# EAGLE design shupito (EAGLE 6.3)
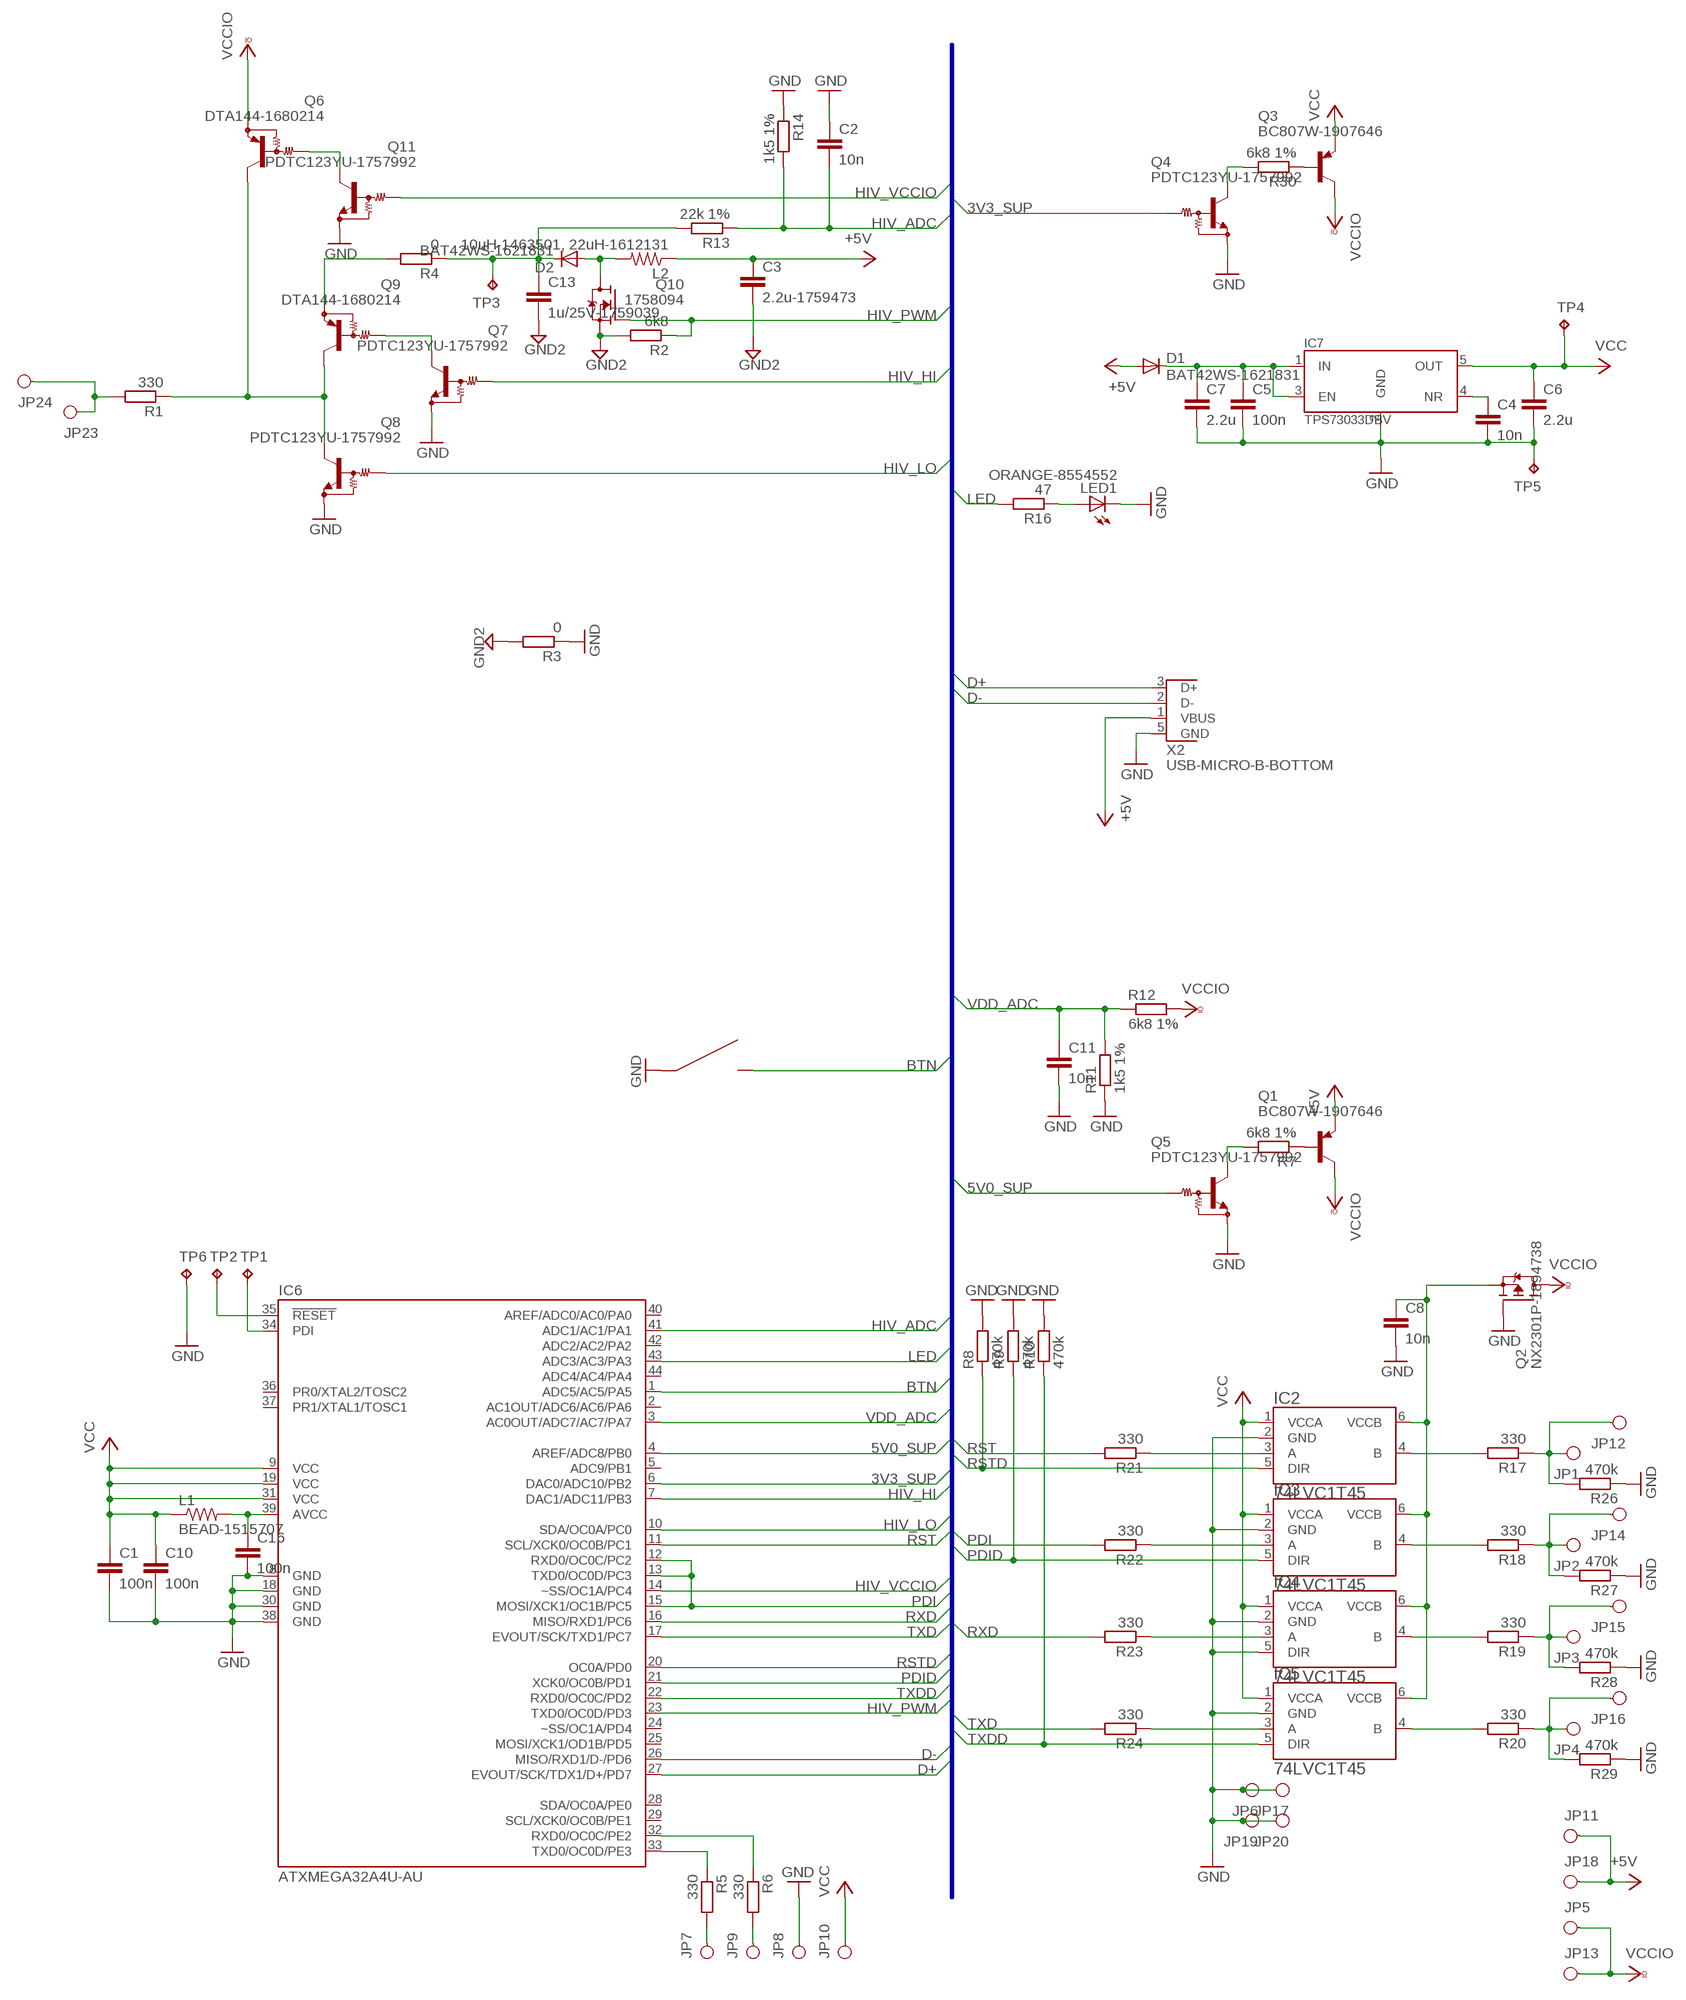
[diagram p0: schematic, sheet 1]

## Parts
C1  100n  C-EUC0603K  [C0603K]
C2  10n  C-EUC0603K  [C0603K]
C3  2.2u-1759473  C-EUC0603K  [C0603K]
C4  10n  C-EUC0603K  [C0603K]
C5  100n  C-EUC0603K  [C0603K]
C6  2.2u  C-EUC0603K  [C0603K]
C7  2.2u  C-EUC0603K  [C0603K]
C8  10n  C-EUC0603K  [C0603K]
C10  100n  C-EUC0603K  [C0603K]
C11  10n  C-EUC0603K  [C0603K]
C13  1u/25V-1759039  C-EUC0603K  [C0603K]
C16  100n  C-EUC0603K  [C0603K]
D1  BAT42WS-1621831  DIODE-SOD323  [SOD323]
D2  BAT42WS-1621831  DIODE-SOD323  [SOD323]
IC2  74LVC1T45  74LVC1T45DBV  [SOT236]
IC3  74LVC1T45  74LVC1T45DBV  [SOT236]
IC4  74LVC1T45  74LVC1T45DBV  [SOT236]
IC5  74LVC1T45  74LVC1T45DBV  [SOT236]
IC6  ATXMEGA32A4U-AU  [TQFP44]
IC7  TPS73033DBV  [SOT23-DBV]
JP1  PINH1X01SMD  [PINH1X01SMD]
JP2  PINH1X01SMD  [PINH1X01SMD]
JP3  PINH1X01SMD  [PINH1X01SMD]
JP4  PINH1X01SMD  [PINH1X01SMD]
JP5  PINH1X01SMD  [PINH1X01SMD]
JP6  PINH1X01SMD  [PINH1X01SMD]
JP7  PINH1X01SMD  [PINH1X01SMD]
JP8  PINH1X01SMD  [PINH1X01SMD]
JP9  PINH1X01SMD  [PINH1X01SMD]
JP10  PINH1X01SMD  [PINH1X01SMD]
JP11  PINH1X01SMD  [PINH1X01SMD]
JP12  PINH1X01SMD  [PINH1X01SMD]
JP13  PINH1X01SMD  [PINH1X01SMD]
JP14  PINH1X01SMD  [PINH1X01SMD]
JP15  PINH1X01SMD  [PINH1X01SMD]
JP16  PINH1X01SMD  [PINH1X01SMD]
JP17  PINH1X01SMD  [PINH1X01SMD]
JP18  PINH1X01SMD  [PINH1X01SMD]
JP19  PINH1X01SMD  [PINH1X01SMD]
JP20  PINH1X01SMD  [PINH1X01SMD]
JP23  PINH1X01SMD  [PINH1X01SMD]
JP24  PINH1X01SMD  [PINH1X01SMD]
L1  BEAD-1515707  R-US_R0603  [R0603]
L2  10uH-1463501, 22uH-1612131  R-US_R0805  [R0805]
LED1  ORANGE-8554552  LEDCHIPLED_0603  [CHIPLED_0603]
Q1  BC807W-1907646  BC807W  [SOT323-BEC]
Q2  NX2301P-1894738  P-MOSFET-SOT23-GSD  [SOT23]
Q3  BC807W-1907646  BC807W  [SOT323-BEC]
Q4  PDTC123YU-1757992  NPN-BIAS-SOT323-BEC  [SOT323]
Q5  PDTC123YU-1757992  NPN-BIAS-SOT323-BEC  [SOT323]
Q6  DTA144-1680214  PNP-BIAS-SOT323-BEC  [SOT323]
Q7  PDTC123YU-1757992  NPN-BIAS-SOT323-BEC  [SOT323]
Q8  PDTC123YU-1757992  NPN-BIAS-SOT323-BEC  [SOT323]
Q9  DTA144-1680214  PNP-BIAS-SOT323-BEC  [SOT323]
Q10  1758094  N-MOSFET-SOT323-GSD  [SOT323]
Q11  PDTC123YU-1757992  NPN-BIAS-SOT323-BEC  [SOT323]
R1  330  R-EU_R0603  [R0603]
R2  6k8  R-EU_R0603  [R0603]
R3  0  R-EU_R1206  [R1206]
R4  0  R-EU_R1206  [R1206]
R5  330  R-EU_R0603  [R0603]
R6  330  R-EU_R0603  [R0603]
R7  6k8 1%  R-EU_R0603  [R0603]
R8  470k  R-EU_R0603  [R0603]
R9  470k  R-EU_R0603  [R0603]
R10  470k  R-EU_R0603  [R0603]
R11  1k5 1%  R-EU_R0603  [R0603]
R12  6k8 1%  R-EU_R0603  [R0603]
R13  22k 1%  R-EU_R0603  [R0603]
R14  1k5 1%  R-EU_R0603  [R0603]
R16  47  R-EU_R0603  [R0603]
R17  330  R-EU_R0603  [R0603]
R18  330  R-EU_R0603  [R0603]
R19  330  R-EU_R0603  [R0603]
R20  330  R-EU_R0603  [R0603]
R21  330  R-EU_R0603  [R0603]
R22  330  R-EU_R0603  [R0603]
R23  330  R-EU_R0603  [R0603]
R24  330  R-EU_R0603  [R0603]
R26  470k  R-EU_R0603  [R0603]
R27  470k  R-EU_R0603  [R0603]
R28  470k  R-EU_R0603  [R0603]
R29  470k  R-EU_R0603  [R0603]
R30  6k8 1%  R-EU_R0603  [R0603]
S1  KSS241G  [KSS-G]
TP1  TPTP15SQ  [TP15SQ]
TP2  TPTP15SQ  [TP15SQ]
TP3  TPTP15SQ  [TP15SQ]
TP4  TPTP15SQ  [TP15SQ]
TP5  TPTP15SQ  [TP15SQ]
TP6  TPTP15SQ  [TP15SQ]
X2  USB-MICRO-B-BOTTOM  [USB-MICRO-B-BOTTOM-MOLEX]

## Nets
3V3_SUP: IC6.6(DAC0/ADC10/PB2) Q4.1(B)
5V0_SUP: IC6.4(AREF/ADC8/PB0) Q5.1(B)
+5V: C3.1 D1.A JP11.1 JP18.1 L2.1 Q1.2(E) X2.1(VBUS)
BTN: IC6.1(ADC5/AC5/PA5) S1.2
D+: IC6.27(EVOUT/SCK/TDX1/D+/PD7) X2.3(D+)
D-: IC6.26(MISO/RXD1/D-/PD6) X2.2(D-)
GND: C1.2 C2.1 C4.2 C5.2 C6.2 C7.2 C8.2 C10.2 C11.2 C16.2 IC2.2(GND) IC3.2(GND) IC4.2(GND) IC4.5(DIR) IC5.2(GND) IC6.8(GND) IC6.18(GND) IC6.30(GND) IC6.38(GND) IC7.2(GND) JP6.1 JP8.1 JP17.1 JP19.1 JP20.1 LED1.C Q2.1(G) Q4.2(E) Q5.2(E) Q7.2(E) Q8.2(E) Q11.2(E) R3.1 R8.2 R9.2 R10.2 R11.1 R14.1 R26.1 R27.1 R28.1 R29.1 S1.1 TP5.TP TP6.TP X2.5(GND)
GND2: C3.2 C13.2 Q10.2(S) R2.2 R3.2
HIV_ADC: C2.2 IC6.41(ADC1/AC1/PA1) R13.1 R14.2
HIV_HI: IC6.7(DAC1/ADC11/PB3) Q7.1(B)
HIV_LO: IC6.10(SDA/OC0A/PC0) Q8.1(B)
HIV_PWM: IC6.23(TXD0/OC0D/PD3) Q10.1(G) R2.1
HIV_VCCIO: IC6.14(~SS/OC1A/PC4) Q11.1(B)
LED: IC6.43(ADC3/AC3/PA3) R16.2
N$1: IC6.33(TXD0/OC0D/PE3) R5.1
N$2: IC6.35(!RESET) TP2.TP
N$3: IC6.34(PDI) TP1.TP
N$4: D2.A L2.2 Q10.3(D)
N$5: IC2.4(B) R17.2
N$6: C16.1 IC6.39(AVCC) L1.2
N$7: JP2.1 JP14.1 R18.1 R27.2
N$8: JP23.1 JP24.1 R1.2
N$9: IC3.4(B) R18.2
N$10: Q6.1(B) Q11.3(C)
N$11: Q9.2(E) R4.2
N$12: IC6.32(RXD0/OC0C/PE2) R6.1
N$13: C5.1 C7.1 D1.C IC7.1(IN) IC7.3(EN)
N$14: JP7.1 R5.2
N$15: LED1.A R16.1
N$16: Q7.3(C) Q9.1(B)
N$17: C4.1 IC7.4(NR)
N$18: JP9.1 R6.2
N$19: Q1.1(B) R7.1
N$22: C13.1 D2.C R4.1 R13.2 TP3.TP
N$23: Q5.3(C) R7.2
N$25: IC4.4(B) R19.2
N$26: Q4.3(C) R30.2
N$27: IC5.4(B) R20.2
N$28: Q3.1(B) R30.1
N$29: C8.1 IC2.6(VCCB) IC3.6(VCCB) IC4.6(VCCB) IC5.6(VCCB) Q2.2(S)
N$30: IC2.3(A) R21.1
N$31: IC3.3(A) R22.1
N$32: IC4.3(A) R23.1
N$33: IC5.3(A) R24.1
N$35: JP1.1 JP12.1 R17.1 R26.2
N$36: JP3.1 JP15.1 R19.1 R28.2
N$37: JP4.1 JP16.1 R20.1 R29.2
N$40: Q6.3(C) Q8.3(C) Q9.3(C) R1.1
PDI: IC6.12(RXD0/OC0C/PC2) IC6.13(TXD0/OC0D/PC3) IC6.15(MOSI/XCK1/OC1B/PC5) R22.2
PDID: IC3.5(DIR) IC6.21(XCK0/OC0B/PD1) R9.1
RST: IC6.11(SCL/XCK0/OC0B/PC1) R21.2
RSTD: IC2.5(DIR) IC6.20(OC0A/PD0) R8.1
RXD: IC6.16(MISO/RXD1/PC6) R23.2
TXD: IC6.17(EVOUT/SCK/TXD1/PC7) R24.2
TXDD: IC5.5(DIR) IC6.22(RXD0/OC0C/PD2) R10.1
VCC: C1.1 C6.1 C10.1 IC2.1(VCCA) IC3.1(VCCA) IC4.1(VCCA) IC5.1(VCCA) IC6.9(VCC) IC6.19(VCC) IC6.31(VCC) IC7.5(OUT) JP10.1 L1.1 Q3.2(E) TP4.TP
VCCIO: JP5.1 JP13.1 Q1.3(C) Q2.3(D) Q3.3(C) Q6.2(E) R12.2
VDD_ADC: C11.1 IC6.3(AC0OUT/ADC7/AC7/PA7) R11.2 R12.1
Unconnected: IC6.2(AC1OUT/ADC6/AC6/PA6) IC6.5(ADC9/PB1) IC6.24(~SS/OC1A/PD4) IC6.25(MOSI/XCK1/OD1B/PD5) IC6.28(SDA/OC0A/PE0) IC6.29(SCL/XCK0/OC0B/PE1) IC6.36(PR0/XTAL2/TOSC2) IC6.37(PR1/XTAL1/TOSC1) IC6.40(AREF/ADC0/AC0/PA0) IC6.42(ADC2/AC2/PA2) IC6.44(ADC4/AC4/PA4)

## Buses
RST,PDI,RXD,TXD,RSTD,PDID,TXDD,USB_RX,USB_TX,5V0_SUP,3V3_SUP,VDD_ADC,SYS_CLK,USB_XCK,PWR_EN,USB_VCC,D+,D-,USB_PDI,USB_PDO,USB_SCK,USB_RX,USB_TX,SYS_CLK,USB_XCK,LED,PWR_EN,SWITCHED_5V,EM_BOOT,USB_CTS,USB_RTR,SYS_CLK,HIV_ADC,HIV_PWM,HIV_HI,HIV_LO,HIV_VCCIO,BTN

## Library data of the parts
C1-C8 C10 C11 C13 C16 = rcl:C-EU: CAPACITOR, European symbol
D1 D2 = diode:DIODE: DIODE ultra fast-recovery rectifier
IC2-IC5 = 74lvc1t45:74*1T45
IC6 = xmega:ATXMEGA*A4U
IC7 = tps73033:TPS73033
JP1-JP20 JP23 JP24 = pinhead_smd:PINH1X01
L1 L2 = rcl:R-US_: RESISTOR, American symbol
LED1 = led:LED: LED OSRAM: - CHIPLED LG R971, LG N971, LY N971, LG Q971, LY Q971, LO R971, LY R971 LH N974, LH R974 LS Q976, LO Q976, LY Q976 LO Q996 - Hyper CHIPLED LW Q18S LB Q993, LB Q99A, LB R99A - SideLED LS A670, LO A670, LY A670, LG A670, LP A670 LB A673, LV A673, LT A673, LW A673 LH A674 LY A675 LS A676, LA A676, LO A676, LY A676, LW A676 LS A679, LY A679, LG A679 - Hyper Micro SIDELED® LS Y876, LA Y876, LO Y876, LY Y876 LT Y87S - SmartLED LW L88C, LW L88S LB L89C, LB L89S, LG L890 LS L89K, LO L89K, LY L89K LS L896, LA L896, LO L896, LY L896 - TOPLED LS T670, LO T670, LY T670, LG T670, LP T670 LSG T670, LSP T670, LSY T670, LOP T670, LYG T670 LG T671, LOG T671, LSG T671 LB T673, LV T673, LT T673, LW T673 LH T674 LS T676, LA T676, LO T676, LY T676, LB T676, LH T676, LSB T676, LW T676 LB T67C, LV T67C, LT T67C, LS T67K, LO T67K, LY T67K, LW E67C LS E67B, LA E67B, LO E67B, LY E67B, LB E67C, LV E67C, LT E67C LW T67C LS T679, LY T679, LG T679 LS T770, LO T770, LY T770, LG T770, LP T770 LB T773, LV T773, LT T773, LW T773 LH T774 LS E675, LA E675, LY E675, LS T675 LS T776, LA T776, LO T776, LY T776, LB T776 LHGB T686 LT T68C, LB T68C - Hyper Mini TOPLED® LB M676 - Mini TOPLED Santana® LG M470 LS M47K, LO M47K, LY M47K Source: http://www.osram.convergy.de LUXEON: - LUMILED® LXK2-PW12-R00, LXK2-PW12-S00, LXK2-PW14-U00, LXK2-PW14-V00 LXK2-PM12-R00, LXK2-PM12-S00, LXK2-PM14-U00 LXK2-PE12-Q00, LXK2-PE12-R00, LXK2-PE12-S00, LXK2-PE14-T00, LXK2-PE14-U00 LXK2-PB12-K00, LXK2-PB12-L00, LXK2-PB12-M00, LXK2-PB14-N00, LXK2-PB14-P00, LXK2-PB14-Q00 LXK2-PR12-L00, LXK2-PR12-M00, LXK2-PR14-Q00, LXK2-PR14-R00 LXK2-PD12-Q00, LXK2-PD12-R00, LXK2-PD12-S00 LXK2-PH12-R00, LXK2-PH12-S00 LXK2-PL12-P00, LXK2-PL12-Q00, LXK2-PL12-R00 Source: www.luxeon.com KINGBRIGHT: KA-3528ASYC Source: www.kingbright.com
Q1 Q3 = transistor-pnp:BC807*: PNP Transistror
Q2 = transistors:P-MOSFET
Q4 Q5 Q7 Q8 Q11 = transistors:NPN-BIAS
Q6 Q9 = transistors:PNP-BIAS
Q10 = transistors:N-MOSFET
R1-R14 R16-R24 R26-R30 = rcl:R-EU_: RESISTOR, European symbol
S1 = switch:KSS
TP1-TP6 = testpad:TP: Test pad
X2 = usb:USB

## Board
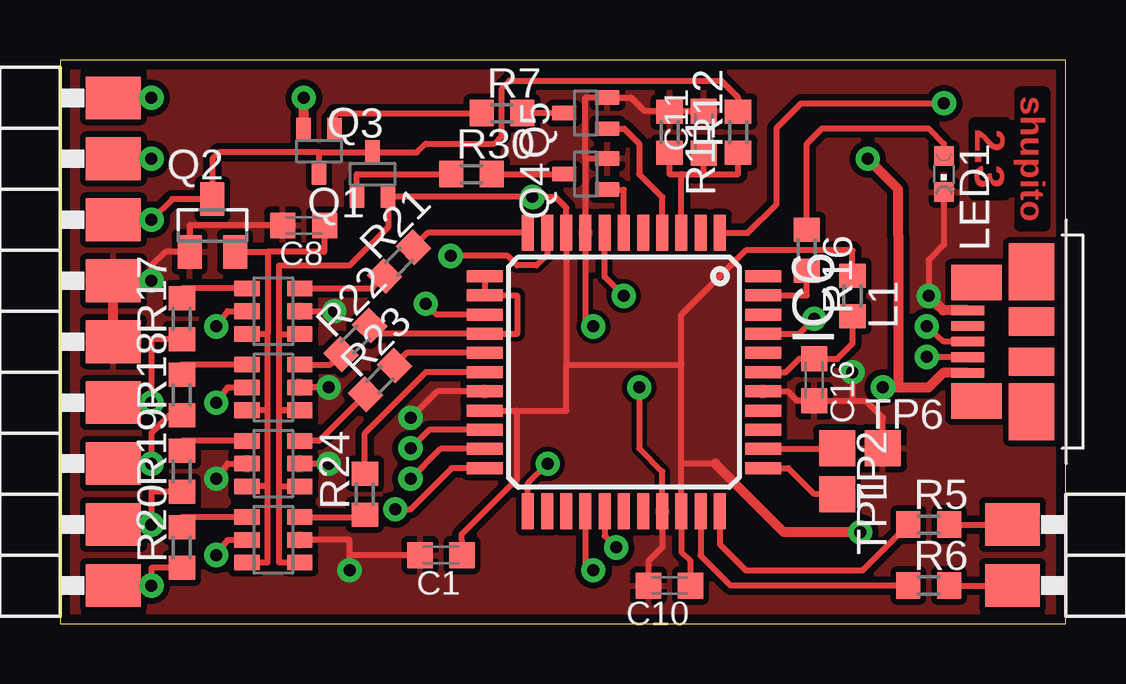
[diagram p1: board, top side]
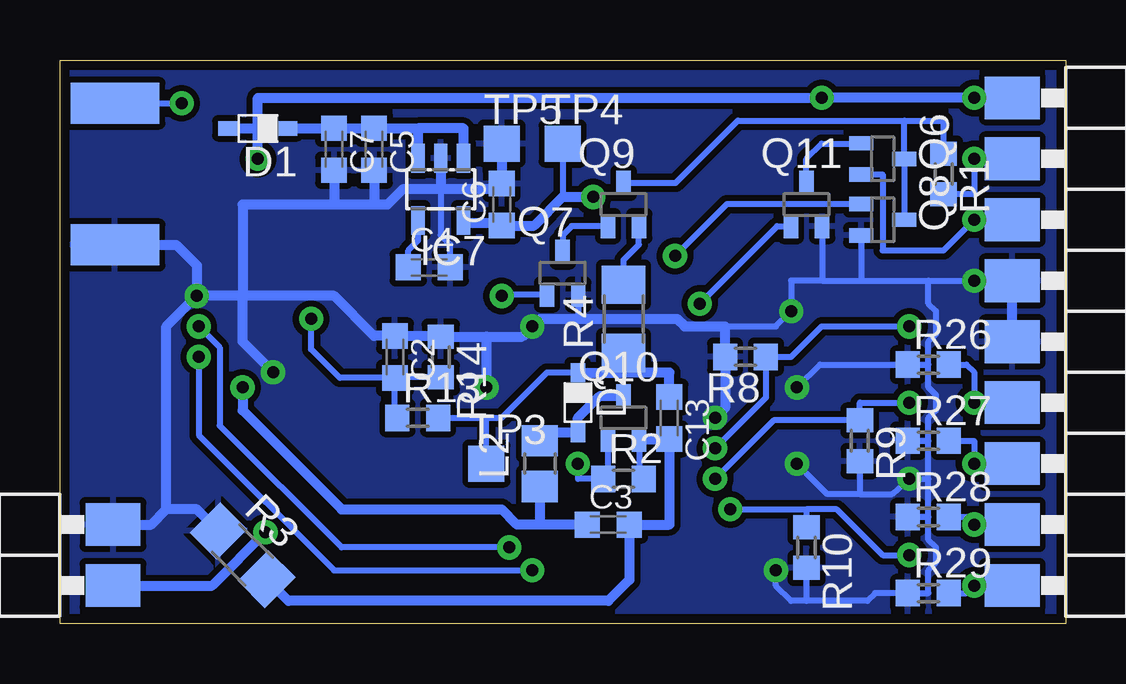
[diagram p2: board, bottom side, seen from below]

Size 41.9 x 23.48 mm. Coordinates in mm from the lower left corner, seen from the top.
Outline: 0,0 41.9,0 41.9,23.48 0,23.48 0,0
Copper layers (1*16): Top 0.018mm / dielectric 1.5mm / Bottom 0.018mm
Design rules "default *": minimum track width 0.2mm, minimum drill 0.5mm, track to track 0.2mm, track to pad 0.2mm, pad to pad 0.2mm, via to via 0.2mm, smd to smd 0mil, copper to edge 0.4mm, drill to drill 0.4mm, minimum pad ring 10mil, minimum via ring 10mil, stop-mask expansion 4mil, vias tented up to drill 0.4mm, thermal gap 10mil

### Footprints (pad centres in the part's own frame; a part is rotated, then mirrored left to right if it is on the bottom)
C0603K = smd 1.05 x 1.08: 1 -0.875,0; 2 0.875,0
SOD323 = smd 0.8 x 0.6: A 1.25,0; C -1.25,0
SOT236 = smd 0.65 x 1.06: 1 -0.95,-1.1; 2 0,-1.1; 3 0.95,-1.1; 4 0.95,1.1; 5 0,1.1; 6 -0.95,1.1
TQFP44 = smd 1.5 x 0.5: 1 -5.8,4; 2 -5.8,3.2; 3 -5.8,2.4; 4 -5.8,1.6; 5 -5.8,0.8; 6 -5.8,0; 7 -5.8,-0.8; 8 -5.8,-1.6; 9 -5.8,-2.4; 10 -5.8,-3.2; 11 -5.8,-4; 23 5.8,-4; 24 5.8,-3.2; 25 5.8,-2.4; 26 5.8,-1.6; 27 5.8,-0.8; 28 5.8,0; 29 5.8,0.8; 30 5.8,1.6; 31 5.8,2.4; 32 5.8,3.2; 33 5.8,4 | smd 0.5 x 1.5: 12 -4,-5.8; 13 -3.2,-5.8; 14 -2.4,-5.8; 15 -1.6,-5.8; 16 -0.8,-5.8; 17 0,-5.8; 18 0.8,-5.8; 19 1.6,-5.8; 20 2.4,-5.8; 21 3.2,-5.8; 22 4,-5.8; 34 4,5.8; 35 3.2,5.8; 36 2.4,5.8; 37 1.6,5.8; 38 0.8,5.8; 39 0,5.8; 40 -0.8,5.8; 41 -1.6,5.8; 42 -2.4,5.8; 43 -3.2,5.8; 44 -4,5.8
SOT23-DBV = smd 0.55 x 1.2: 1 -0.95,-1.3; 2 0,-1.3; 3 0.95,-1.3; 4 0.95,1.3; 5 -0.95,1.3
PINH1X01SMD = smd 1.778 x 2.286: 1 0,-2.223
R0603 = smd 1 x 1.1: 1 -0.85,0; 2 0.85,0
R0805 = smd 1.3 x 1.5: 1 -0.95,0; 2 0.95,0
CHIPLED_0603 = smd 0.8 x 0.8: A 0,-0.75; C 0,0.75
SOT323-BEC = smd 0.6 x 1: 1 -0.65,-0.9; 2 0.65,-0.9; 3 0,0.9
SOT23 = smd 1 x 1.4: 1 -0.95,-1.1; 2 0.95,-1.1; 3 0,1.1
SOT323 = smd 0.6 x 1: 1 -0.65,-0.9; 2 0.65,-0.9; 3 0,0.9
R1206 = smd 1.6 x 1.803: 1 -1.422,0; 2 1.422,0
KSS-G = smd 1.7 x 3.7: 1 -2.95,0; 2 2.95,0
TP15SQ = smd 1.5 x 1.5: TP 0,0
USB-MICRO-B-BOTTOM-MOLEX = smd 1.38 x 0.4: 1 2.66,1.3; 2 2.66,0.65; 3 2.66,0; 4 2.66,-0.65; 5 2.66,-1.3 | smd 1.9 x 2.375: S@1 0,2.913; S@4 0,-2.913 | smd 1.9 x 1.175: S@2 0,0.838; S@3 0,-0.838 | smd 2.1 x 1.475: S@5 2.3,2.462; S@6 2.3,-2.462

### Placement (x,y rotation side)
C1  15.88,2.86 180 top
C2  27.94,11.11 270 bottom
C3  19.05,4.13 0 bottom
C4  26.51,14.84 0 bottom
C5  28.81,19.76 270 bottom
C6  23.5,17.46 90 bottom
C7  30.48,19.76 270 bottom
C8  10.16,16.59 180 top
C10  25.4,1.59 180 top
C11  26.83,20.48 90 top
C13  16.51,8.57 270 bottom
C16  31.43,10.16 270 top
D1  33.66,20.64 180 bottom
D2  20.32,9.21 270 bottom
IC2  8.89,13.02 90 top
IC3  8.89,9.84 90 top
IC4  8.89,6.67 90 top
IC5  8.89,3.49 90 top
IC6  23.5,10.48 270 top
IC7  26.04,18.1 180 bottom
JP1  0,9.21 90 top
JP2  0,6.67 90 top
JP3  0,4.13 90 top
JP4  0,1.59 90 top
JP5  0,16.83 90 top
JP6  0,14.29 90 top
JP7  41.91,4.13 270 top
JP8  41.91,4.13 90 bottom
JP9  41.91,1.59 270 top
JP10  41.91,1.59 90 bottom
JP11  0,21.91 90 top
JP12  0,9.21 270 bottom
JP13  0,16.83 270 bottom
JP14  0,6.67 270 bottom
JP15  0,4.13 270 bottom
JP16  0,1.59 270 bottom
JP17  0,14.29 270 bottom
JP18  0,21.91 270 bottom
JP19  0,11.75 90 top
JP20  0,11.75 270 bottom
JP23  0,19.37 270 bottom
JP24  0,19.37 90 top
L1  33.02,13.65 270 top
L2  21.91,6.67 90 bottom
LED1  36.83,18.73 180 top
Q1  10.79,19.69 180 top
Q2  6.35,16.59 0 top
Q3  13.02,18.73 0 top
Q4  21.91,18.73 90 top
Q5  21.91,21.27 90 top
Q6  7.62,19.37 270 bottom
Q7  20.95,14.6 0 bottom
Q8  7.62,16.83 270 bottom
Q9  18.41,17.46 0 bottom
Q10  PMF280UN,115-1758094  [SOT323]  18.41,8.57 0 bottom
Q11  10.79,17.46 0 bottom
R1  5.08,18.73 270 bottom
R2  18.41,6.03 0 bottom
R3  34.29,2.86 315 bottom
R4  18.41,12.7 90 bottom
R5  36.2,4.13 0 top
R6  36.2,1.59 0 top
R7  18.41,21.27 0 top
R8  13.34,11.11 180 bottom
R9  8.57,7.62 270 bottom
R10  10.8,3.18 270 bottom
R11  25.4,20.48 270 top
R12  28.26,20.48 90 top
R13  26.99,8.57 0 bottom
R14  26.04,11.11 270 bottom
R16  31.11,15.56 270 top
R17  5.08,12.7 90 top
R18  5.08,9.52 90 top
R19  5.08,6.35 90 top
R20  5.08,3.18 90 top
R21  14.13,15.08 45 top
R22  12.3,11.83 45 top
R23  13.34,10.16 45 top
R24  12.7,5.4 90 top
R26  5.71,10.79 0 bottom
R27  5.71,7.62 0 bottom
R28  5.71,4.45 0 bottom
R29  5.71,1.27 0 bottom
R30  17.14,18.73 0 top
S1  39.61,18.73 90 bottom
TP1  32.38,5.4 270 top
TP2  32.38,7.3 270 top
TP3  24.13,6.67 0 bottom
TP4  20.95,20 0 bottom
TP5  23.5,20 0 bottom
TP6  34.29,7.3 0 top
X2  40.48,11.75 180 top

### Tracks (layer width: path | path; a pad name or v marks a point on that pad's centre or on a via)
3V3_SUP
  Top 0.254: Q4.1 23.5,18.08 IC6.6
5V0_SUP
  Top 0.254: IC6.4 25.09,17.77 24.13,18.73 24.13,20 23.51,20.62 Q5.1
+5V  (via drill 0.5)
  Top 0.254: 34.92,17.46 34.92,16.19
  Top 0.406: Q1.2 10.16,21.22 v10.16,21.91 | JP11.1 v3.81,21.91 | v33.66,19.37 34.92,18.1 34.92,16.19 34.92,9.84 | X2.1 36.8,10.45 36.2,9.84 34.92,9.84 | v34.29,9.84 34.92,9.84
  Bottom 0.406: JP11.1 v3.81,21.91 v10.16,21.91 33.66,21.91 33.66,20.64 | C3.1 21.91,4.13 | 21.91,4.13 22.86,4.13 23.5,4.76 30.16,4.76 34.29,8.89 v34.29,9.84 | L2.1 21.91,4.13 | v33.66,19.37 33.66,20.64 | D1.A 33.66,20.64
BTN  (via drill 0.5)
  Top 0.254: IC6.1 28.66,16.28 29.84,17.46 29.84,20.64 30.89,21.68 v36.83,21.68
  Bottom 0.254: S1.2 v36.83,21.68
D+  (via drill 0.5)
  Top 0.254: IC6.27 22.7,3.66 v23.18,3.18 | X2.3 36.83,11.75 v36.12,12.38
  Bottom 0.254: v36.12,12.38 35.24,11.51 35.24,8.25 30.16,3.18 v23.18,3.18
D-  (via drill 0.5)
  Top 0.254: X2.2 36.18,11.1 v36.12,11.11 | IC6.26 21.89,2.55 v22.23,2.22
  Bottom 0.254: v22.23,2.22 30.48,2.22 36.12,7.86 v36.12,11.11
GND  (via drill 0.5)
  Top 0.254: v11.19,9.84 IC3.2 | v11.19,6.67 IC4.2 | IC4.5 6.99,6.67 v6.51,6.03 | IC5.2 12.06,3.49 12.06,2.86 | v12.06,2.22 12.06,2.86 | v14.61,8.57 15.71,9.68 IC6.18 | 21.89,19.38 Q4.2 | 21.89,19.38 21.89,21.92 Q5.2 23.8,21.92 24.37,21.35 25.4,21.35 | IC2.2 v11.43,13.02 | C1.2 12.06,2.86 | 21.89,19.38 IC6.8 21.89,12.71 v22.23,12.38 | v24.13,9.84 24.13,7.3 25.09,6.34 IC6.30 25.09,3.19 24.52,2.62 C10.2 | v3.81,14.29 3.81,14.92 4.38,15.49 Q2.1 5.4,16.59 C8.2 | LED1.C 36.83,15.78 36.2,15.15 v36.2,13.65 | C11.2 25.4,21.35 | 25.4,21.35 R11.1 | IC6.38 30.33,9.68 30.72,9.28 C16.2 33.02,9.28 | TP6.TP 34.29,8.57 33.58,9.28 33.02,9.28 | v33.02,10.48 33.02,9.28
  Top 0.406: v3.81,14.29 JP17.1 JP20.1 | X2.5 36.8,13.05 v36.2,13.65
  Bottom 0.254: v11.19,9.84 10.24,10.8 R26.1 5.71,10.8 | 10.14,14.29 11.43,14.29 v11.43,13.02 12.06,12.38 14.19,12.38 | R27.1 5.71,7.62 | 5.71,4.45 5.71,6.03 | 5.71,6.03 5.71,7.62 | 5.71,6.03 v6.51,6.03 7.22,5.4 8.57,5.4 | Q8.2 8.52,14.29 | 8.52,14.29 5.71,14.29 | 5.71,14.29 v3.81,14.29 | Q11.2 10.14,14.29 | 10.14,14.29 8.52,14.29 | R28.1 5.71,4.45 | 26.04,11.99 R14.1 | Q7.2 20.3,12.7 | C4.2 25.64,15.79 26.04,16.19 26.04,18.1 | 10.79,0.95 8.26,0.95 7.94,1.27 R29.1 5.71,1.27 5.71,2.22 5.4,2.54 5.4,3.18 5.71,3.49 5.71,4.45 | 10.79,0.95 11.43,0.95 12.06,1.59 v12.06,2.22 | R10.2 10.79,0.95 | 10.79,0.95 | R9.2 8.57,5.4 | 8.57,5.4 9.92,5.4 v11.19,6.67 | 5.71,10.8 5.71,11.75 5.4,12.07 5.4,13.02 5.71,13.33 5.71,14.29 | 5.71,7.62 5.71,8.57 5.4,8.89 5.4,9.52 5.71,9.84 5.71,10.8
  Bottom 0.406: IC7.2 26.04,18.1 | 26.04,18.1 23.5,18.1 C6.2 TP5.TP | 34.29,13.65 30.48,13.65 28.82,11.99 C2.1 26.04,11.99 | v33.02,10.48 34.29,11.75 34.29,13.65 | v14.61,8.57 14.19,8.99 R8.2 14.19,12.38 15.88,12.38 16.19,12.7 20.3,12.7 21.91,12.7 v22.23,12.38 22.64,11.96 24.13,11.96 | R14.1 24.13,11.96 | 24.13,11.96 v24.13,9.84 | 26.04,18.1 27.62,18.1 28.26,17.46 28.81,17.46 | 28.81,17.46 30.48,17.46 | C7.2 30.48,17.46 | C5.2 28.81,17.46 | JP20.1 JP17.1 v3.81,14.29 | 34.29,13.65 v36.2,13.65 | JP8.1 38.1,4.13 37.47,4.76 | R3.1 36.2,4.76 37.47,4.76 | 30.48,17.46 34.29,17.46 34.29,13.65 | S1.1 37.05,15.78 36.2,14.92 v36.2,13.65 | 37.47,4.76 37.47,12.38 v36.2,13.65
  pour Top (isolate 0.254, rank 2): 0,-0.32 41.91,-0.32 41.91,23.81 0,23.81
  pour Bottom (isolate 0.254): 0,-0.32 41.91,-0.32 41.91,23.81 0,23.81
GND2
  Bottom 0.254: Q10.2 17.77,6.03 R2.2
  Bottom 0.406: Q10.2 16.51,7.67 C13.2 16.51,4.13 C3.2 18.18,1.83 19.05,0.95 32.38,0.95 R3.2
HIV_ADC  (via drill 0.5)
  Top 0.254: IC6.41 30.81,12.08 v31.43,12.7
  Bottom 0.254: v31.43,12.7 31.43,11.43 30.24,10.24 C2.2 | R14.2 27.94,10.26 C2.2 | R13.1 27.94,8.57 C2.2
HIV_HI  (via drill 0.5)
  Top 0.254: v23.5,13.65 22.7,14.45 IC6.7
  Bottom 0.254: Q7.1 23.44,13.71 v23.5,13.65
HIV_LO  (via drill 0.5)
  Top 0.254: IC6.10 20.3,15.37 19.84,14.92 19.05,14.92 18.65,15.32 v16.27,15.32
  Bottom 0.254: Q8.1 14.11,17.48 v16.27,15.32
HIV_PWM  (via drill 0.5)
  Top 0.254: IC6.23 19.5,5.84 v20.32,6.67
  Bottom 0.254: Q10.1 19.07,6.03 R2.1 20.32,6.03 v20.32,6.67
HIV_VCCIO  (via drill 0.5)
  Top 0.254: IC6.14 15.7,12.88 v15.24,13.33
  Bottom 0.254: 11.45,16.81 Q11.1 12.01,16.56 v15.24,13.33
LED
  Top 0.254: IC6.43 31.11,13.68 R16.2
N$1
  Top 0.254: IC6.33 27.5,3.3 28.57,2.22 33.44,2.22 R5.1
N$2
  Top 0.254: IC6.35 32.41,7.28 TP2.TP
N$3
  Top 0.254: IC6.34 30.35,6.48 31.43,5.4 TP1.TP
N$4
  Bottom 0.406: Q10.3 19.42,9.47 20.32,8.57 D2.A 21.91,7.96 L2.2
N$5
  Top 0.254: IC2.4 5.08,13.97 R17.2
N$6
  Top 0.254: L1.2 33.02,11.67 32.39,11.03 C16.1 30.8,11.03 30.24,10.48 IC6.39
N$7  (via drill 0.5)
  Top 0.254: v3.81,6.67 3.81,7.94 4.55,8.67 R18.1
  Top 0.406: v3.81,6.67 JP14.1
  Bottom 0.254: R27.2 3.81,7.62 v3.81,6.67
  Bottom 0.406: JP14.1 v3.81,6.67
N$8  (via drill 0.5)
  Top 0.406: v3.81,19.37 JP23.1
  Bottom 0.254: v3.81,19.37 3.81,17.88 R1.2
  Bottom 0.406: JP23.1 v3.81,19.37
N$9
  Top 0.254: IC3.4 5.08,10.79 R18.2
N$10
  Bottom 0.254: Q11.3 10.79,19.37 10.16,20 8.54,20 Q6.1
N$11
  Bottom 0.254: R4.2 18.41,15.16 17.78,15.8 17.78,16.55 Q9.2
N$12
  Top 0.254: R6.1 27.94,1.59 26.7,2.83 IC6.32
N$13
  Bottom 0.406: D1.C C7.1 C5.1 26.98,20.64 | 26.98,20.64 IC7.3 | IC7.1 25.09,20.64 26.98,20.64
N$14
  Top 0.254: R5.2 JP7.1
N$15
  Top 0.254: R16.1 31.11,20 31.75,20.64 36.2,20.64 36.83,20 LED1.A
N$16
  Bottom 0.254: Q9.1 20.59,16.56 20.95,16.19 Q7.3
N$17
  Bottom 0.254: IC7.4 26.98,15.96 27.39,15.56 C4.1
N$18
  Top 0.254: R6.2 JP9.1
N$19
  Top 0.254: Q1.1 11.45,21.27 R7.1
N$22
  Bottom 0.254: R13.2 24.13,8.57 | 24.13,8.57 23.5,8.57 21.61,10.46 D2.C | TP3.TP 24.13,8.57
  Bottom 0.406: D2.C 18.41,10.46 | R4.1 18.41,10.46 | C13.1 16.51,10.46 18.41,10.46
N$23
  Top 0.254: R7.2 | Q5.3 R7.2
N$25
  Top 0.254: IC4.4 5.08,7.62 R19.2
N$26
  Top 0.254: R30.2 Q4.3
N$27
  Top 0.254: IC5.4 5.08,4.44 R20.2
N$28
  Top 0.254: Q3.1 12.37,18.73 R30.1
N$29
  Top 0.254: 8.65,12.07 IC2.6 | 8.65,8.89 IC3.6 | 8.65,8.89 8.65,12.07 | 8.65,5.72 IC4.6 | 8.65,5.72 8.65,8.89 | IC5.6 8.65,2.54 8.65,5.72 | 8.65,15.49 8.65,12.07 | Q2.2 8.65,15.49 | C8.1 11.01,15.49 8.65,15.49
N$30
  Top 0.254: IC2.3 13.02,13.97 R21.1
N$31
  Top 0.254: IC3.3 11.27,10.79 R22.1
N$32
  Top 0.254: R23.1 10.79,7.62 IC4.3
N$33
  Top 0.254: IC5.3 12.7,4.44 R24.1
N$35  (via drill 0.5)
  Top 0.254: v3.81,9.21 3.81,11.85 R17.1
  Top 0.406: JP1.1 v3.81,9.21
  Bottom 0.254: R26.2 4.13,10.8 3.81,10.48 v3.81,9.21
  Bottom 0.406: v3.81,9.21 JP1.1
N$36  (via drill 0.5)
  Top 0.254: R19.1 3.81,5.5 v3.81,4.13
  Top 0.406: JP3.1 v3.81,4.13
  Bottom 0.254: R28.2 4.13,4.45 v3.81,4.13
  Bottom 0.406: v3.81,4.13 JP3.1
N$37  (via drill 0.5)
  Top 0.254: JP4.1 v3.81,1.59 3.81,2.33 R20.1
  Bottom 0.254: JP4.1 v3.81,1.59 4.13,1.27 R29.2
N$40
  Bottom 0.254: Q8.3 Q6.3 6.72,20.96 | 6.72,20.96 13.65,20.96 16.25,18.36 Q9.3 | 6.72,20.96 5.08,20.96 R1.1
PDI
  Top 0.254: R22.2 13.26,12.08 IC6.15 19.05,12.08 19.05,13.68 IC6.13 IC6.12
PDID  (via drill 0.5)
  Top 0.254: v14.61,6.03 15.85,7.28 IC6.21 | v6.51,9.21 6.99,9.84 IC3.5
  Bottom 0.254: v6.51,9.21 8.57,9.21 R9.1 12.17,8.47 v14.61,6.03
RST
  Top 0.254: IC6.11 15.32,16.28 R21.2
RSTD  (via drill 0.5)
  Top 0.254: v6.51,12.38 6.99,13.02 IC2.5 | v14.61,7.3 15.38,8.08 IC6.20
  Bottom 0.254: v6.51,12.38 10.16,12.38 11.43,11.11 R8.1 12.48,9.42 v14.61,7.3
RXD
  Top 0.254: R23.2 14.45,11.28 IC6.16
TXD
  Top 0.254: R24.2 12.7,7.94 15.24,10.48 IC6.17
TXDD  (via drill 0.5)
  Top 0.254: v6.51,2.86 6.99,3.49 IC5.5 | v13.97,4.76 14.61,4.76 16.32,6.48 IC6.22
  Bottom 0.254: v13.97,4.76 10.79,4.76 | 10.79,4.76 R10.1 | v6.51,2.86 7.62,2.86 9.53,4.76 10.79,4.76
VCC  (via drill 0.5)
  Top 0.254: IC5.1 9.13,2.54 9.13,5.72 | IC2.1 9.13,12.07 9.13,8.89 | 9.13,5.72 IC4.1 | 9.13,5.72 9.13,8.89 | 9.13,8.89 IC3.1 9.13,8.89 | 13.67,17.78 v19.68,17.78 20.64,17.78 21.09,17.32 IC6.9 21.09,10.8 | 13.67,17.78 Q3.2 | IC6.19 19.05,8.88 | 9.13,8.89 9.13,14.92 12.06,14.92 13.67,16.53 13.67,17.78 | 19.05,8.88 19.05,6.03 16.73,3.71 C1.1 | C10.1 26.27,2.62 25.89,3 IC6.31 25.89,6.67 | 25.89,6.67 25.89,10.8 | 25.89,10.8 25.89,12.88 28.57,15.56 33.02,15.56 L1.1 | 21.09,10.8 25.89,10.8 | 19.05,8.88 21.09,8.88 21.09,10.8 | 27.3,6.67 25.89,6.67
  Top 0.406: v33.34,3.81 30.16,3.81 27.3,6.67
  Bottom 0.254: IC7.5 25.09,16.7 | 23.5,16.7 C6.1 | TP4.TP 20.95,17.78
  Bottom 0.406: 25.09,16.7 23.5,16.7 | C6.1 22.15,16.59 20.95,17.78 v19.68,17.78 | v33.34,3.81 35.56,1.59 JP10.1
  pour Top (isolate 0.2): 18.81,15.16 18.81,5.79 28.18,5.79 28.18,15.16
VCCIO  (via drill 0.5)
  Top 0.254: R12.2 28.26,21.91 27.54,22.62 18.73,22.62 18.41,22.3 18.41,20.32 18.1,20 15.24,20 14.87,19.63 Q3.3 10.79,19.63 | Q1.3 10.79,19.63 | 10.79,19.63 6.62,19.63 6.35,19.37 Q2.3 4.67,17.69 v3.81,16.83
  Top 0.406: v3.81,16.83 JP13.1
  Bottom 0.254: Q6.2 7.62,18.72 7.62,15.56 5.08,15.56 v3.81,16.83
  Bottom 0.406: JP13.1 v3.81,16.83
VDD_ADC
  Top 0.254: R11.2 25.4,18.73 25.89,18.73 | 26.83,18.73 C11.1 | 26.83,18.73 28.26,18.73 R12.1 | 25.89,18.73 26.83,18.73 | IC6.3 25.89,18.73

### Text on the board
Top: 2.3 | shupito